# Altium project UZ_PER_SiC_inverter_828xcc.PrjPCB (part 2 of 2)

## Sheet Connectors.SchDoc
size A4; Author: Veit Starost; CompanyName: Technische Hochschule Nürnberg Georg Simon Ohm; Organization: UltraZohm; Address1: Kesslerplatz 12; Address2: 90489 Nürnberg; Address3: GERMANY; Website: www.ultrazohm.com
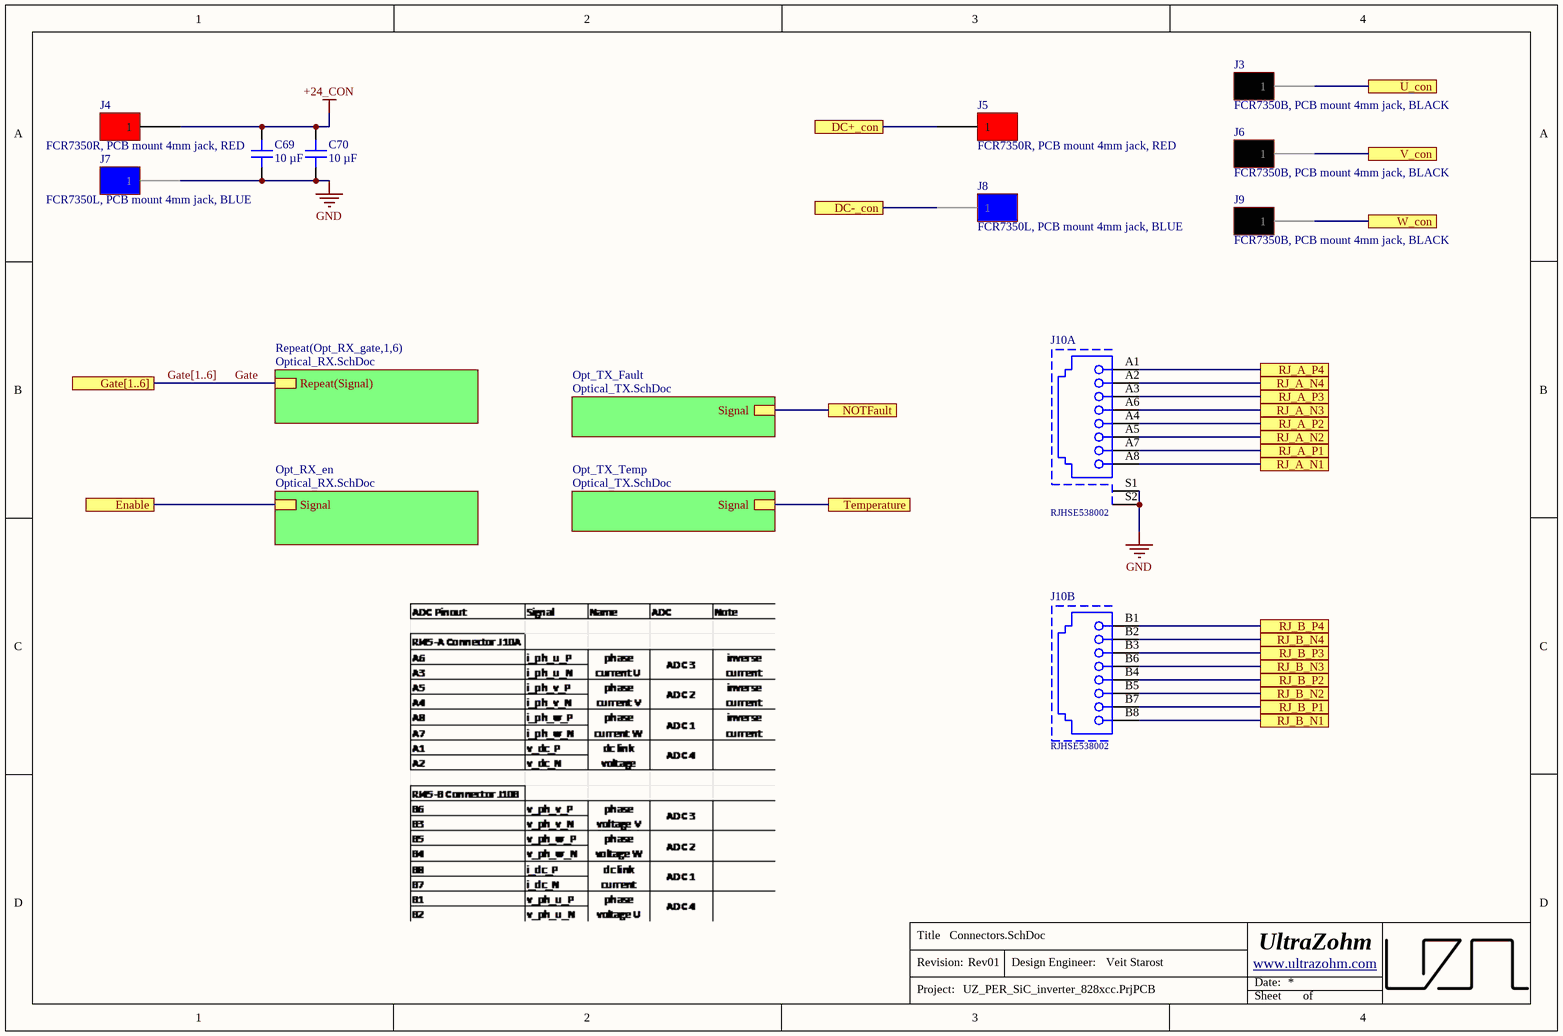
[diagram p4: Connectors.SchDoc]

### Parts
C69  10 µF  [C_1206]
C70  10 µF  [C_1206]
J3  FCR7350B, PCB mount 4mm jack, BLACK  [FCR7350]
J4  FCR7350R, PCB mount 4mm jack, RED  [FCR7350]
J5  FCR7350R, PCB mount 4mm jack, RED  [FCR7350]
J6  FCR7350B, PCB mount 4mm jack, BLACK  [FCR7350]
J7  FCR7350L, PCB mount 4mm jack, BLUE  [FCR7350]
J8  FCR7350L, PCB mount 4mm jack, BLUE  [FCR7350]
J9  FCR7350B, PCB mount 4mm jack, BLACK  [FCR7350]
J10  RJHSE538002  [RJHSE-5380-02]  (parts A,B of 2)

### Sub-sheets
Opt_RX_en = Optical_RX.SchDoc: Signal
Opt_TX_Fault = Optical_TX.SchDoc: Signal
Opt_TX_Temp = Optical_TX.SchDoc: Signal
Repeat(Opt_RX_gate,1,6) = Optical_RX.SchDoc: Repeat(Signal)

### Ports
DC+_con, DC-_con, Enable, Gate[1..6], NOTFault, RJ_A_N1, RJ_A_N2, RJ_A_N3, RJ_A_N4, RJ_A_P1, RJ_A_P2, RJ_A_P3, RJ_A_P4, RJ_B_N1, RJ_B_N2, RJ_B_N3, RJ_B_N4, RJ_B_P1, RJ_B_P2, RJ_B_P3, RJ_B_P4, Temperature, U_con, V_con, W_con

### Nets
+24_CON: C69.2 C70.2 J4.1
DC-: J8.1 ; port DC-_con
GND: C69.1 C70.1 J7.1 J10.S1 J10.S2
Gate: sheet Repeat(Opt_RX_gate,1,6)/Repeat(Signal)
I_IN1: J3.1 ; port U_con
I_IN2: J6.1 ; port V_con
I_IN3: J9.1 ; port W_con
I_IN4: J5.1 ; port DC+_con
I_OUT_N1: J10.A3 ; port RJ_A_P3
I_OUT_N2: J10.A4 ; port RJ_A_P2
I_OUT_N3: J10.A7 ; port RJ_A_P1
I_OUT_N4: J10.B8 ; port RJ_B_N1
I_OUT_P1: J10.A6 ; port RJ_A_N3
I_OUT_P2: J10.A5 ; port RJ_A_N2
I_OUT_P3: J10.A8 ; port RJ_A_N1
I_OUT_P4: J10.B7 ; port RJ_B_P1
V_OUT_N1: J10.B2 ; port RJ_B_N4
V_OUT_N2: J10.B6 ; port RJ_B_N3
V_OUT_N3: J10.B5 ; port RJ_B_N2
V_OUT_N4: J10.A2 ; port RJ_A_N4
V_OUT_P1: J10.B1 ; port RJ_B_P4
V_OUT_P2: J10.B3 ; port RJ_B_P3
V_OUT_P3: J10.B4 ; port RJ_B_P2
V_OUT_P4: J10.A1 ; port RJ_A_P4
NetIC6_6: port Temperature, sheet Opt_TX_Temp/Signal
NetIC10G_4: port Enable, sheet Opt_RX_en/Signal
NetIC11A_2: port NOTFault, sheet Opt_TX_Fault/Signal

### Buses and harness runs
bus Gate[1..6] = port Gate[1..6]

### Notes on the sheet
- Title
- Revision:
- Design Engineer:
- Date:
- Project:
- Sheet
- of

### Library data of the parts
C69 C70 = CGA5L1X7R1H106K160AC: Capacitor 1206, 50 VDC, 10 µF, X7R; Manufacturer: TDK; Tolerance: 10 %; Voltage Rating: 50 VDC; Created from: MGremer; Manufacturer Part Number: CGA5L1X7R1H106K160AC; PartID: 25; Created On: 20.12.2020 13:54:13; ComponentLink1Description: Datasheet; ComponentLink1URL: https://product.tdk.com/info/en/catalog/datasheets/mlcc_automotive_general_en.pdf; Component Type: Capacitor 1206; Device Package: 1206; Last Updated: 27.05.2022 14:15:21; Mounting Type: SMD; Operating Temperature: -55 - 125°C; Series: CGA; Supplier 1: Mouser; Supplier Part Number 1: 810-CGA5L1X7R1H106K1; Type: Capacitor; Value: 10 µF; Live Cycle Status: 1; LCSC Part Number: C13585; Stock number: Labor SMD Container
J3 J6 J9 = FCR7350B: FCR7350B, 1000V, 24A, BLACK; Manufacturer: Cliff; Value: PCB mount 4mm jack, Black	FCR7350B, 1000V, 24A; Created from: DHufnagel; Manufacturer Part Number: FCR7350B; PartID: 6; Created On: 13.06.2022 10:18:11; ComponentLink1Description: datasheet; ComponentLink1URL: https://www.cliffuk.co.uk/products/testleads/sockets/S16NPC.pdf; ComponentLink2Description: drawing; ComponentLink2URL: https://media.digikey.com/pdf/Data%20Sheets/Cliff%20Electronic%20LTD%20PDF's/FCR7350_Drawing.pdf; Component Type: PCB mount 4mm jack, Black; Device Package: THT; Last Updated: 28.06.2022 13:58:37; Minimum Order: 1; Mounting Type: THT; Operating Temperature: -40°C - 80°C; Series: S16N-PC; Supplier 1: Digi-Key; Supplier Part Number 1: 3185-FCR7350B-ND; Supplier 2: farnell; Supplier Part Number 2: 1854507; Type: PCB mount 4mm jack, Black	FCR7350B, 1000V, 24A; Live Cycle Status: 1; Stock number: not stored
J4 J5 = FCR7350R: FCR7350B, 1000V, 24A, RED; Manufacturer: Cliff; Value: PCB mount 4mm jack, Red FCR7350R, 1000V, 24A; Created from: DHufnagel; Manufacturer Part Number: FCR7350R; PartID: 7; Created On: 13.06.2022 10:18:11; ComponentLink1Description: datasheet; ComponentLink1URL: https://www.cliffuk.co.uk/products/testleads/sockets/S16NPC.pdf; ComponentLink2Description: drawing; ComponentLink2URL: https://media.digikey.com/pdf/Data%20Sheets/Cliff%20Electronic%20LTD%20PDF's/FCR7350_Drawing.pdf; Component Type: PCB mount 4mm jack, Red; Device Package: THT; Last Updated: 28.06.2022 13:58:37; Minimum Order: 1; Mounting Type: THT; Operating Temperature: -40°C - 80°C; Series: S16N-PC; Supplier 1: Digi-Key; Supplier Part Number 1: 3185-FCR7350R-ND; Supplier 2: farnell; Supplier Part Number 2: 1854508; Type: PCB mount 4mm jack, Red FCR7350R, 1000V, 24A; Live Cycle Status: 1; Stock number: not stored
J7 J8 = FCR7350L: FCR7350B, 1000V, 24A, BLUE; Manufacturer: Cliff; Value: PCB mount 4mm jack, Blue FCR7350L, 1000V, 24A; Created from: DHufnagel; Manufacturer Part Number: FCR7350L; PartID: 8; Created On: 13.06.2022 10:18:11; ComponentLink1Description: datasheet; ComponentLink1URL: https://www.cliffuk.co.uk/products/testleads/sockets/S16NPC.pdf; ComponentLink2Description: drawing; ComponentLink2URL: https://media.digikey.com/pdf/Data%20Sheets/Cliff%20Electronic%20LTD%20PDF's/FCR7350_Drawing.pdf; Component Type: PCB mount 4mm jack, Blue; Device Package: THT; Last Updated: 28.06.2022 13:58:37; Minimum Order: 1; Mounting Type: THT; Operating Temperature: -40°C - 80°C; Series: S16N-PC; Supplier 1: Digi-Key; Supplier Part Number 1: 3185-FCR7350L-ND; Supplier 2: farnell; Supplier Part Number 2: 1854511; Type: PCB mount 4mm jack, Blue FCR7350L, 1000V, 24A; Live Cycle Status: 1; Stock number: not stored
J10 = RJHSE538002: CAT5, RJ45 Connector, 1x2; Manufacturer: Amphenol; Created from: MGremer; Manufacturer Part Number: RJHSE538002; PartID: 4; Created On: 22.02.2021 16:43:38; ComponentLink1Description: Datasheet; ComponentLink1URL: https://www.farnell.com/cad/2360382.pdf; Component Type: RJ45 Connector; Device Package: RJ45; Last Updated: 22.02.2021 16:43:38; Mounting Type: THT; Series: RJHSE; Supplier 1: Farnell; Supplier Part Number 1: 1860605; Type: RJ45 Connector; Live Cycle Status: 1; Stock number: not stored

## Sheet Optical_RX.SchDoc
size A4; Author: Veit Starost; CompanyName: Technische Hochschule Nürnberg Georg Simon Ohm; Organization: UltraZohm; Address1: Kesslerplatz 12; Address2: 90489 Nürnberg; Address3: GERMANY; Website: www.ultrazohm.com
Used 7 times, as channels U_Connectors/Opt_RX_gate1, U_Connectors/Opt_RX_gate2, U_Connectors/Opt_RX_gate3, U_Connectors/Opt_RX_gate4, U_Connectors/Opt_RX_gate5, U_Connectors/Opt_RX_gate6, U_Connectors/Opt_RX_en. Parts and nets are listed once, with the designators drawn on the sheet.
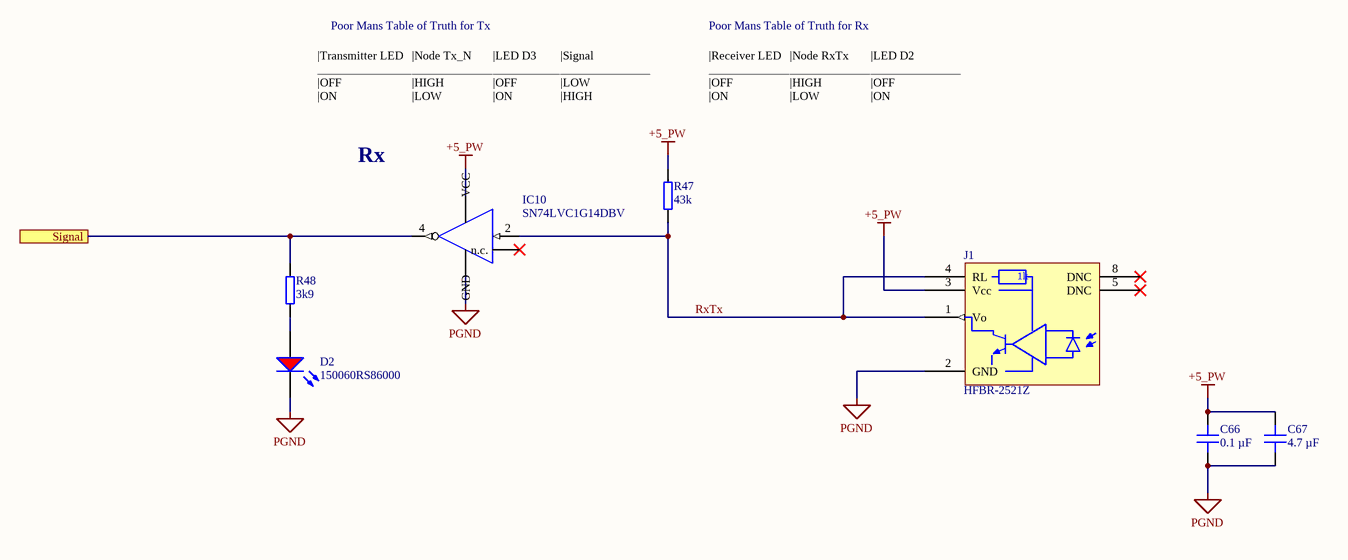
[diagram p5: Optical_RX.SchDoc]

### Parts
C66  0.1 µF  [C_0603]
C67  4.7 µF  [C_0805]
D2  150060RS86000  [WL-SMCW_0603]
IC10  SN74LVC1G14DBV  [SOT23-5_L]
J1  HFBR-2521Z  [HFBRx5XX]
R47  43k  [RES 0603_1608]
R48  3k9  [RES 0603_1608]

### Ports
Signal

### Nets
+5_PW: C66.2 C67.2 IC10.5(VCC) J1.3(Vcc) R47.2
PGND: C66.1 C67.1 D2.1(K) IC10.3(GND) J1.2(GND)
RxTx: IC10.2(A) J1.1(Vo) J1.4(RL) R47.1
Signal: IC10.4(~{Y}) R48.2 ; port Signal
NetD2_2: D2.2(A) R48.1

Not connected (* = marked no-connect by the designer): IC10 1(n.c.)*; J1 5(DNC)* 8(DNC)*

### Channels
U_Connectors/Opt_RX_gate1: designators end in A; ports Signal=Gate1
U_Connectors/Opt_RX_gate2: designators end in B; ports Signal=Gate2
U_Connectors/Opt_RX_gate3: designators end in C; ports Signal=Gate3
U_Connectors/Opt_RX_gate4: designators end in D; ports Signal=Gate4
U_Connectors/Opt_RX_gate5: designators end in E; ports Signal=Gate5
U_Connectors/Opt_RX_gate6: designators end in F; ports Signal=Gate6
U_Connectors/Opt_RX_en: designators end in G; ports Signal=NetIC10G_4

### Notes on the sheet
- Poor Mans Table of Truth for Tx
- Poor Mans Table of Truth for Rx
- |Transmitter LED
  _________________
  |OFF
  |ON
- |Node Tx_N
  _________________
  |HIGH
  |LOW
- |LED D3
  _______________
  |OFF
  |ON
- GATE
  _______
  LOW
  HIGH
- |Signal
  _______________
  |LOW
  |HIGH
- |Receiver LED
  ________________
  |OFF
  |ON
- |Node RxTx
  _________________
  |HIGH
  |LOW
- |LED D2
  _______________
  |OFF
  |ON
- Rx
- Title
- Revision:
- Design Engineer:
- Date:
- Project:
- Sheet
- of
- (in symbol HFBR-2521Z) 1k

### Library data of the parts
C66 = C0603X104K5RAC7411: Capacitor 0603, 50 VDC, 0.1 µF, X7R; Manufacturer: KEMET; Tolerance: 10 %; Voltage Rating: 50 VDC; Created from: MGremer; Manufacturer Part Number: C0603X104K5RAC7411; PartID: 3; Created On: 20.12.2020 13:54:13; ComponentLink1Description: Datasheet; ComponentLink1URL: https://www.mouser.de/datasheet/2/212/1/KEM_C1013_X7R_FT_CAP_SMD-1103280.pdf; Component Type: Capacitor 0603; Device Package: 0603; Last Updated: 04.03.2021 09:24:28; Mounting Type: SMD; Operating Temperature: -55 - 125°C; Series: SMD Comm X7R Flex; Supplier 1: Mouser; Supplier Part Number 1: 80-C0603X104K5R7411; Supplier 2: LCSC; Supplier Part Number 2: C14663; Type: Capacitor; Value: 0.1 µF; Live Cycle Status: 1; LCSC Part Number: C14663; Stock number: Labor SMD Container
C67 = C2012X7R1H475K125AC: Capacitor 0805, 50 VDC, 4.7 µF, X7R; Manufacturer: TDK; Tolerance: 10 %; Voltage Rating: 50 VDC; Created from: MGremer; Manufacturer Part Number: C2012X7R1H475K125AC; PartID: 15; Created On: 20.12.2020 13:54:13; ComponentLink1Description: Datasheet; ComponentLink1URL: https://product.tdk.com/info/en/catalog/datasheets/mlcc_commercial_general_en.pdf; Component Type: Capacitor 0805; Device Package: 0805; Last Updated: 20.12.2020 16:34:30; Mounting Type: SMD; Operating Temperature: -55 - 125°C; Series: C; Supplier 1: Mouser; Supplier Part Number 1: 810-C2012X7R475K125C; Type: Capacitor; Value: 4.7 µF; Live Cycle Status: 1; Stock number: Labor SMD Container
D2 = 150060RS86000: WL-SMCW SMD Mono-color Chip LED Waterclear Red; Manufacturer: Wuerth Elektronik; Type: Standard; Created from: MGremer; Forward Current I_f: 20 mA; Forward Voltage U_f: 2 V; Wavelength: 624 nm; Light Intensity: 800 mcd; Nominal Power: 48 mW; Manufacturer Part Number: 150060RS86000; PartID: 3; Created On: 08.12.2020 10:48:12; ComponentLink1Description: Datasheet; ComponentLink1URL: https://www.mouser.de/datasheet/2/445/150120RS75000-1714636.pdf; Component Type: LED Diode; Device Package: 0603; Last Updated: 15.02.2023 18:12:03; Mounting Type: SMD; Operating Temperature: -40 - 85 °C; Supplier 1: Mouser; Supplier Part Number 1: 710-150060RS86000; Supplier 2: Farnell; Supplier Part Number 2: 3408608; Supplier 3: Digi-Key; Supplier Part Number 3: 732-150060RS86000CT-ND; Live Cycle Status: 1; Stock number: not stored; Color: red; LCSC Part Number: C389517
IC10 = SN74LVC1G14DBV: Inverting Schmitt trigger; Manufacturer: Texas Instruments; Value: 5.5 V; Created from: VStarost; Manufacturer Part Number: SN74LVC1G14DBV; PartID: 3; Created On: 13.12.2022 09:50:11; ComponentLink1Description: Datasheet; ComponentLink1URL: https://www.ti.com/lit/ds/symlink/sn74lvc1g14.pdf?HQS=dis-mous-null-mousermode-dsf-pf-null-wwe&ts=1670840401866&ref_url=https%253A%252F%252Fwww.mouser.de%252F; Component Type: Inverting Schmitt trigger; Device Package: SOT-23-5; Last Updated: 15.02.2023 18:15:19; Mounting Type: SMD; Operating Temperature: -40 - 125 °C; Series: SN74LVC1G14; Supplier 1: Mouser; Supplier Part Number 1: 595-SN74LVC1G14DBVT; Type: Schmitt trigger; Live Cycle Status: 1; Stock number: not stored; LCSC Part Number: C434069
J1 = HFBR-2521Z: Fibre Optic Receivers, LINK HORIZ 5MBd RC VR RoHS; Suppier Part Number 2: 516-2062-ND; Manufacturer: Broadcom; MF: Boadcom/Avago; Wavelength: 660 nm; Iout max: 25 mA; Supply Voltage: 5V; Created from: VStarost; Created: 2019_04_09_Kreppel; MPN: HFBR-2521Z; Data Rate: 5 MBd; Supplier 1: Mouser; Supplier Part Number 1: 630-HFBR-2521Z; Manufacturer Part Number: HFBR-2521Z; PartID: 1; Created On: 27.12.2022 09:44:37; ComponentLink1Description: Datasheet; ComponentLink1URL: https://datasheet.ciiva.com/19453/1584669-19453911.pdf?src-supplier=Jameco; Component Type: LWL Receiver; Device Package: THT; Last Updated: 27.12.2022 09:44:37; Mounting Type: THT; Series: HFBR; Type: LWL Receiver; Live Cycle Status: 1; Stock number: not stored
R47 = RK73B1JTTD433J: SMD resistor E24 series; Manufacturer: KOA Speer; Tolerance: 5%; Created from: MGremer; Manufacturer Part Number: RK73B1JTTD433J; PartID: 113; Created On: 14.12.2020 16:17:14; ComponentLink1Description: Datasheet; ComponentLink1URL: https://www.mouser.de/datasheet/2/219/RK73B-1825463.pdf; Component Type: SMD resistor; Device Package: 0603; Last Updated: 15.02.2023 17:49:44; Mounting Type: SMD; Supplier 1: Mouser; Supplier Part Number 1: 660-RK73B1JTTD433J; Type: Resistor; Value: 43k; Live Cycle Status: 1; Stock number: Labor SMD Container; LCSC Part Number: C177391
R48 = RK73B1JTTDD392J: SMD resistor E24 series; Manufacturer: KOA Speer; Tolerance: 5%; Created from: MGremer; Manufacturer Part Number: RK73B1JTTDD392J; PartID: 88; Created On: 14.12.2020 16:17:14; ComponentLink1Description: Datasheet; ComponentLink1URL: https://www.mouser.de/datasheet/2/219/RK73B-1825463.pdf; Component Type: SMD resistor; Device Package: 0603; Last Updated: 15.02.2023 17:47:58; Mounting Type: SMD; Supplier 1: Mouser; Supplier Part Number 1: 660-RK73B1JTTDD392J; Type: Resistor; Value: 3k9; Live Cycle Status: 1; Stock number: Labor SMD Container; LCSC Part Number: C177310

## Sheet Optical_TX.SchDoc
size A4; Author: Veit Starost; CompanyName: Technische Hochschule Nürnberg Georg Simon Ohm; Organization: UltraZohm; Address1: Kesslerplatz 12; Address2: 90489 Nürnberg; Address3: GERMANY; Website: www.ultrazohm.com
Used 2 times, as channels U_Connectors/Opt_TX_Fault, U_Connectors/Opt_TX_Temp. Parts and nets are listed once, with the designators drawn on the sheet.
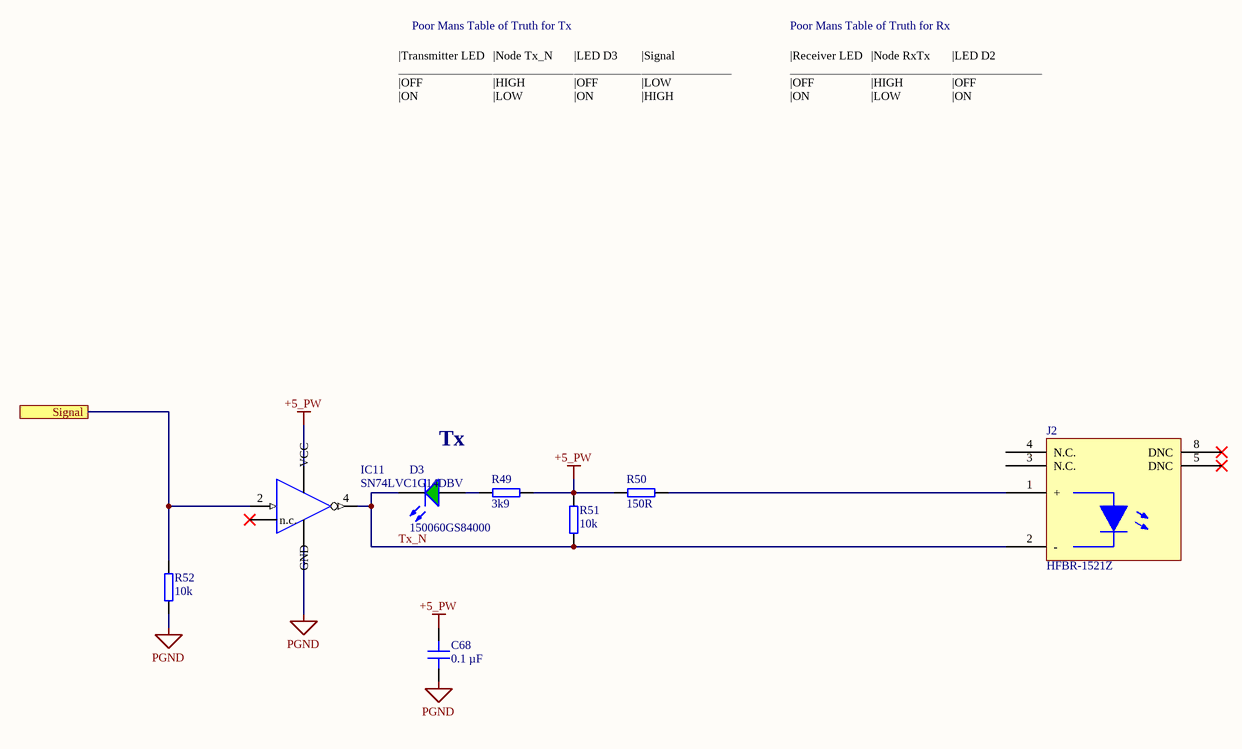
[diagram p6: Optical_TX.SchDoc]

### Parts
C68  0.1 µF  [C_0603]
D3  150060GS84000  [WL-SMCW_0603]
IC11  SN74LVC1G14DBV  [SOT23-5_L]
J2  HFBR-1521Z  [HFBRx5XX]
R49  3k9  [RES 0603_1608]
R50  150R  [RES 0603_1608]
R51  10k  [RES 0603_1608]
R52  10k  [RES 0603_1608]

### Ports
Signal

### Nets
+5_PW: C68.2 IC11.5(VCC) R49.2 R50.1 R51.2
PGND: C68.1 IC11.3(GND) R52.1
Signal: IC11.2(A) R52.2 ; port Signal
Tx_N: D3.1(K) IC11.4(~{Y}) J2.2(-) R51.1
NetD3_2: D3.2(A) R49.1
NetJ2_1: J2.1(+) R50.2

Not connected (* = marked no-connect by the designer): IC11 1(n.c.)*; J2 3(N.C.) 4(N.C.) 5(DNC)* 8(DNC)*

### Channels
U_Connectors/Opt_TX_Fault: designators end in A; ports Signal=NetIC11A_2
U_Connectors/Opt_TX_Temp: designators end in B; ports Signal=NetIC6_6

### Notes on the sheet
- Poor Mans Table of Truth for Tx
- Poor Mans Table of Truth for Rx
- |Transmitter LED
  _________________
  |OFF
  |ON
- |Node Tx_N
  _________________
  |HIGH
  |LOW
- |LED D3
  _______________
  |OFF
  |ON
- GATE
  _______
  LOW
  HIGH
- |Signal
  _______________
  |LOW
  |HIGH
- |Receiver LED
  ________________
  |OFF
  |ON
- |Node RxTx
  _________________
  |HIGH
  |LOW
- |LED D2
  _______________
  |OFF
  |ON
- Tx
- Title
- Revision:
- Design Engineer:
- Date:
- Project:
- Sheet
- of

### Library data of the parts
C68 = C0603X104K5RAC7411: as C66 on sheet Optical_RX; Manufacturer Part Number: C0603X104K5RAC7411; PartID: 3; Created On: 20.12.2020 13:54:13; ComponentLink1Description: Datasheet; ComponentLink1URL: https://www.mouser.de/datasheet/2/212/1/KEM_C1013_X7R_FT_CAP_SMD-1103280.pdf; Component Type: Capacitor 0603; Device Package: 0603; Last Updated: 04.03.2021 09:24:28; Mounting Type: SMD; Operating Temperature: -55 - 125°C; Series: SMD Comm X7R Flex; Supplier 1: Mouser; Supplier Part Number 1: 80-C0603X104K5R7411; Supplier 2: LCSC; Supplier Part Number 2: C14663; Type: Capacitor; Value: 0.1 µF; Live Cycle Status: 1; LCSC Part Number: C14663; Stock number: Labor SMD Container
D3 = 150060GS84000: WL-SMCW SMD Mono-color Chip LED Waterclear Green; Manufacturer: Wuerth Elektronik; Type: Standard; Created from: MGremer; Forward Current I_f: 20 mA; Forward Voltage U_f: 3.2 V; Wavelength: 525 nm; Light Intensity: 3000 mcd; Nominal Power: 78 mW; Manufacturer Part Number: 150060GS84000; PartID: 2; Created On: 08.12.2020 10:41:11; ComponentLink1Description: Datasheet; ComponentLink1URL: https://www.mouser.de/datasheet/2/445/150060GS75020-1714345.pdf; Component Type: LED Diode; Device Package: 0603; Last Updated: 03.03.2021 09:59:51; Mounting Type: SMD; Operating Temperature: -40 - 85 °C; Supplier 1: Mouser; Supplier Part Number 1: 710-150060GS84000; Supplier 2: Farnell; Supplier Part Number 2: 3408612; Supplier 3: Digi-Key; Supplier Part Number 3: 732-150060GS84000CT-ND; Live Cycle Status: 1; Stock number: not stored; Color: green
IC11 = SN74LVC1G14DBV: as IC10 on sheet Optical_RX; Manufacturer Part Number: SN74LVC1G14DBV; PartID: 3; Created On: 13.12.2022 09:50:11; ComponentLink1Description: Datasheet; ComponentLink1URL: https://www.ti.com/lit/ds/symlink/sn74lvc1g14.pdf?HQS=dis-mous-null-mousermode-dsf-pf-null-wwe&ts=1670840401866&ref_url=https%253A%252F%252Fwww.mouser.de%252F; Component Type: Inverting Schmitt trigger; Device Package: SOT-23-5; Last Updated: 15.02.2023 18:15:19; Mounting Type: SMD; Operating Temperature: -40 - 125 °C; Series: SN74LVC1G14; Supplier 1: Mouser; Supplier Part Number 1: 595-SN74LVC1G14DBVT; Type: Schmitt trigger; Live Cycle Status: 1; Stock number: not stored; LCSC Part Number: C434069
J2 = HFBR-1521Z: Fibre Optic Transmitters, Link Horiz 5MBd Tx RoHS; Manufacturer: Broadcom; MF: Broadcom/Avago; Wavelength: 660 nm; Foreward Current: 60 mA; Supply Voltage: 5V; Created from: VStarost; Created: 2019_04_09_Kreppel; MPN: HFBR-1521Z; Data Rate: 5 MBd; Supplier 1: Mouser; Supplier Part Number 1: 630-HFBR-1521Z; Manufacturer Part Number: HFBR-1521Z; PartID: 2; Created On: 27.12.2022 10:35:16; ComponentLink1Description: Datasheet; ComponentLink1URL: https://datasheet.ciiva.com/19453/1584669-19453911.pdf?src-supplier=Jameco; Component Type: LWL Transmitter; Device Package: THT; Last Updated: 27.12.2022 10:35:16; Mounting Type: THT; Series: HFBR; Type: LWL Transmitter; Live Cycle Status: 1; Stock number: not stored
R49 = RK73B1JTTDD392J: as R48 on sheet Optical_RX; Manufacturer Part Number: RK73B1JTTDD392J; PartID: 88; Created On: 14.12.2020 16:17:14; ComponentLink1Description: Datasheet; ComponentLink1URL: https://www.mouser.de/datasheet/2/219/RK73B-1825463.pdf; Component Type: SMD resistor; Device Package: 0603; Last Updated: 15.02.2023 17:47:58; Mounting Type: SMD; Supplier 1: Mouser; Supplier Part Number 1: 660-RK73B1JTTDD392J; Type: Resistor; Value: 3k9; Live Cycle Status: 1; Stock number: Labor SMD Container; LCSC Part Number: C177310
R50 = RK73B1JTTD151J: SMD resistor E24 series; Manufacturer: KOA Speer; Tolerance: 5%; Created from: MGremer; Manufacturer Part Number: RK73B1JTTD151J; PartID: 54; Created On: 14.12.2020 16:17:14; ComponentLink1Description: Datasheet; ComponentLink1URL: https://www.mouser.de/datasheet/2/219/RK73B-1825463.pdf; Component Type: SMD resistor; Device Package: 0603; Last Updated: 27.05.2022 13:41:55; Mounting Type: SMD; Supplier 1: Mouser; Supplier Part Number 1: 660-RK73B1JTTD151J; Type: Resistor; Value: 150R; Live Cycle Status: 1; Stock number: Labor SMD Container; LCSC Part Number: C22808
R51 R52 = RK73B1JTTD103J: SMD resistor E24 series; Manufacturer: KOA Speer; Tolerance: 5%; Created from: MGremer; Manufacturer Part Number: RK73B1JTTD103J; PartID: 98; Created On: 14.12.2020 16:17:14; ComponentLink1Description: Datasheet; ComponentLink1URL: https://www.mouser.de/datasheet/2/219/RK73B-1825463.pdf; Component Type: SMD resistor; Device Package: 0603; Last Updated: 27.05.2022 14:04:22; Mounting Type: SMD; Supplier 1: Mouser; Supplier Part Number 1: 660-RK73B1JTTD103J; Type: Resistor; Value: 10k; Live Cycle Status: 1; Stock number: Labor SMD Container; LCSC Part Number: C25804

## Sheet Voltage_Measurement.SchDoc
size A4; Author: Veit Starost; CompanyName: Technische Hochschule Nürnberg Georg Simon Ohm; Organization: UltraZohm; Address1: Kesslerplatz 12; Address2: 90489 Nürnberg; Address3: GERMANY; Website: www.ultrazohm.com
Used 4 times, as channels U_Voltage_Measurement1, U_Voltage_Measurement2, U_Voltage_Measurement3, U_Voltage_Measurement4. Parts and nets are listed once, with the designators drawn on the sheet.
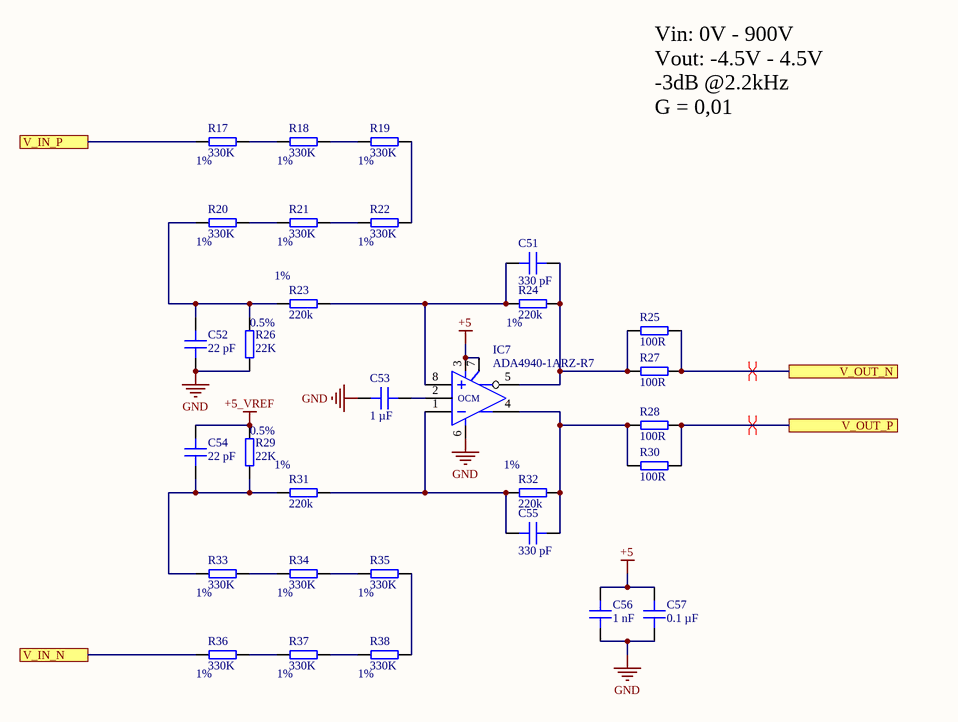
[diagram p7: Voltage_Measurement.SchDoc]

### Parts
C51  330 pF  [C_0603]
C52  22 pF  [C_0603]
C53  1 µF  [C_0603]
C54  22 pF  [C_0603]
C55  330 pF  [C_0603]
C56  1 nF  [C_0603]
C57  0.1 µF  [C_0603]
IC7  ADA4940-1ARZ-R7  [SOIC-8-N]
R17  330K  Tolerance: 1%  [RES 1206_3216]
R18  330K  Tolerance: 1%  [RES 1206_3216]
R19  330K  Tolerance: 1%  [RES 1206_3216]
R20  330K  Tolerance: 1%  [RES 1206_3216]
R21  330K  Tolerance: 1%  [RES 1206_3216]
R22  330K  Tolerance: 1%  [RES 1206_3216]
R23  220k  Tolerance: 1%  [RES 0603_1608]
R24  220k  Tolerance: 1%  [RES 0603_1608]
R25  100R  [RES 0603_1608]
R26  22K  Tolerance: 0.5%  [RES 0603_1608]
R27  100R  [RES 0603_1608]
R28  100R  [RES 0603_1608]
R29  22K  Tolerance: 0.5%  [RES 0603_1608]
R30  100R  [RES 0603_1608]
R31  220k  Tolerance: 1%  [RES 0603_1608]
R32  220k  Tolerance: 1%  [RES 0603_1608]
R33  330K  Tolerance: 1%  [RES 1206_3216]
R34  330K  Tolerance: 1%  [RES 1206_3216]
R35  330K  Tolerance: 1%  [RES 1206_3216]
R36  330K  Tolerance: 1%  [RES 1206_3216]
R37  330K  Tolerance: 1%  [RES 1206_3216]
R38  330K  Tolerance: 1%  [RES 1206_3216]

### Ports
V_IN_N, V_IN_P, V_OUT_N, V_OUT_P

### Nets
+5: C56.2 C57.2 IC7.3(V+) IC7.7(EN)
+5_VREF: C54.2 R29.2
GND: C52.1 C53.1 C56.1 C57.1 IC7.6(V-) R26.1
V_IN_N: R36.1 ; port V_IN_N
V_IN_P: R17.1 ; port V_IN_P
V_OUT_N: R25.2 R27.2 ; port V_OUT_N
V_OUT_P: R28.2 R30.2 ; port V_OUT_P
NetC51_1: C51.1 IC7.8(+) R23.2 R24.1
NetC51_2: C51.2 IC7.5(Out) R24.2 R25.1 R27.1
NetC52_2: C52.2 R20.1 R23.1 R26.2
NetC53_2: C53.2 IC7.2(OCM)
NetC54_1: C54.1 R29.1 R31.1 R33.1
NetC55_1: C55.1 IC7.1(-) R31.2 R32.1
NetC55_2: C55.2 IC7.4(Out) R28.1 R30.1 R32.2
NetR17_2: R17.2 R18.1
NetR18_2: R18.2 R19.1
NetR19_2: R19.2 R22.2
NetR20_2: R20.2 R21.1
NetR21_2: R21.2 R22.1
NetR33_2: R33.2 R34.1
NetR34_2: R34.2 R35.1
NetR35_2: R35.2 R38.2
NetR36_2: R36.2 R37.1
NetR37_2: R37.2 R38.1

### Channels
U_Voltage_Measurement1: designators end in A; ports V_IN_N=DC- V_IN_P=I_M_OUT1 V_OUT_N=V_OUT_N1 V_OUT_P=V_OUT_P1
U_Voltage_Measurement2: designators end in B; ports V_IN_N=DC- V_IN_P=I_M_OUT2 V_OUT_N=V_OUT_N2 V_OUT_P=V_OUT_P2
U_Voltage_Measurement3: designators end in C; ports V_IN_N=DC- V_IN_P=I_M_OUT3 V_OUT_N=V_OUT_N3 V_OUT_P=V_OUT_P3
U_Voltage_Measurement4: designators end in D; ports V_IN_N=DC- V_IN_P=I_M_OUT4 V_OUT_N=V_OUT_N4 V_OUT_P=V_OUT_P4

### Layout directives
differential pair: V_OUT_N1, V_OUT_P1

### Notes on the sheet
- Vin: 0V - 900V
  Vout: -4.5V - 4.5V
  -3dB @2.2kHz
  G = 0,01
- Title
- Revision:
- Design Engineer:
- Date:
- Project:
- Sheet
- of

### Library data of the parts
C51 C55 = C0603X331J5RAC3112: Capacitor 0603, 50 VDC, 330 pF, X7R; Manufacturer: KEMET; Tolerance: 5 %; Voltage Rating: 50 VDC; Created from: MGremer; Manufacturer Part Number: C0603X331J5RAC3112; PartID: 8; Created On: 20.12.2020 13:54:13; ComponentLink1Description: Datasheet; ComponentLink1URL: https://www.mouser.de/datasheet/2/212/1/KEM_C1013_X7R_FT_CAP_SMD-1103280.pdf; Component Type: Capacitor 0603; Device Package: 0603; Last Updated: 15.02.2023 17:14:22; Mounting Type: SMD; Operating Temperature: -55 - 125°C; Series: SMD Comm X7R Flex; Supplier 1: Mouser; Supplier Part Number 1: 80-C0603X331J5R3112; Type: Capacitor; Value: 330 pF; Live Cycle Status: 1; Stock number: Labor SMD Container; Supplier 2: LCSC; Supplier Part Number 2: C107087
C52 C54 = C0603C220J5RACTU: Capacitor 0603, 50 VDC, 22 pF, X7R; Manufacturer: KEMET; Tolerance: 5 %; Voltage Rating: 50 VDC; Created from: MGremer; Manufacturer Part Number: C0603C220J5RACTU; PartID: 78; Created On: 20.12.2020 13:54:13; ComponentLink1Description: Datasheet; ComponentLink1URL: https://www.mouser.de/datasheet/2/212/KEM_C1002_X7R_SMD-1102033.pdf; Component Type: Capacitor 0603; Device Package: 0603; Last Updated: 20.01.2021 13:57:36; Mounting Type: SMD; Operating Temperature: -55 - 125°C; Series: SMD Comm X7R; Supplier 1: Mouser; Supplier Part Number 1: 80-C0603C220J5R; Type: Capacitor; Value: 22 pF; Live Cycle Status: 1; Stock number: not stored
C53 = UMK107AB7105KA-T: 50V 1uF X7R ±10% 0603 Multilayer Ceramic Capacitors MLCC - SMD/SMT ROHS; Manufacturer: Taiyo Yuden; Voltage Rating: 50 VDC; Created from: NDiringer; Manufacturer Part Number: UMK107AB7105KA-T; PartID: 98; Created On: 09.08.2022 09:35:02; ComponentLink1Description: Datasheet; ComponentLink1URL: https://www.mouser.de/datasheet/2/396/mlcc02_e-1307760.pdf; Component Type: Capacitor 0603; Device Package: 0603; Last Updated: 21.09.2022 16:11:37; Mounting Type: SMD; Operating Temperature: -55 - 125°C; Series: X7R; Supplier 1: LCSC; Supplier Part Number 1: C105174; Supplier 2: Mouser; Supplier Part Number 2: 963-UMK107AB7105MA-T; Type: Capacitor; Tolerance: 10 %; Value: 1 µF; Live Cycle Status: 1; LCSC Part Number: C105174; Stock number: not stored
C56 = CC0603JRNPO9BN102: Capacitor 0603, 50 VDC, 1 nF, NP0; Manufacturer: YAGEO; Tolerance: 5 %; Voltage Rating: 50 VDC; Created from: AGeiger; Manufacturer Part Number: CC0603JRNPO9BN102; PartID: 104; Created On: 30.08.2022 11:46:28; ComponentLink1Description: Datasheet; ComponentLink1URL: https://datasheet.lcsc.com/lcsc/1811021411_YAGEO-CC0603JRNPO9BN102_C106246.pdf; Component Type: Capacitor 0603; Device Package: 0603; Last Updated: 30.08.2022 11:46:28; Mounting Type: SMD; Operating Temperature: -55 - 125°C; Series: NP0; Supplier 1: LCSC; Supplier Part Number 1: C106246; Type: Capacitor; Value: 1 nF; Live Cycle Status: 1; LCSC Part Number: C106246
C57 = C0603X104K5RAC7411: as C66 on sheet Optical_RX; Manufacturer Part Number: C0603X104K5RAC7411; PartID: 3; Created On: 20.12.2020 13:54:13; ComponentLink1Description: Datasheet; ComponentLink1URL: https://www.mouser.de/datasheet/2/212/1/KEM_C1013_X7R_FT_CAP_SMD-1103280.pdf; Component Type: Capacitor 0603; Device Package: 0603; Last Updated: 04.03.2021 09:24:28; Mounting Type: SMD; Operating Temperature: -55 - 125°C; Series: SMD Comm X7R Flex; Supplier 1: Mouser; Supplier Part Number 1: 80-C0603X104K5R7411; Supplier 2: LCSC; Supplier Part Number 2: C14663; Type: Capacitor; Value: 0.1 µF; Live Cycle Status: 1; LCSC Part Number: C14663; Stock number: Labor SMD Container
IC7 = ADA4940-1ARZ-R7: Differential ADC Driver; Manufacturer: Analog Devices; Class I: Analog; Class II: Fully Differential ADC Drivers (-40-125°C); Best.-Nr.: Farnell 209-6178; Channels: 1; Created from: MGremer; Datasheet: DSO11449, Ver. Aug 2000; Last edited: 04.01.2007 10:14; Package Reference: SOIC-N-8; Manufacturer Part Number: ADA4940-1ARZ-R7; PartID: 3; Created On: 15.01.2021 12:16:53; ComponentLink1Description: Datasheet; ComponentLink1URL: https://www.mouser.de/datasheet/2/609/ADA4940-1_4940-2-878284.pdf; Component Type: ADC; Device Package: SOIC-8; Last Updated: 22.11.2021 15:19:18; Mounting Type: SMD; Operating Temperature: -40 - 105 °C; Supplier 1: Mouser; Supplier Part Number 1: 584-ADA4940-1ARZ-R7; Type: ADC; Resolution: -; Value: differential ADC driver; Live Cycle Status: 1; Stock number: not stored
R17-R22 R33-R38 = RT1206FRE07330KL: SMD resistor E24 series 330K OHM 1% 50PPM 1/4W; Manufacturer: YAGEO; Created from: StarostV; Manufacturer Part Number: RT1206FRE07330KL; PartID: 254; Created On: 02.02.2023 10:18:00; ComponentLink1Description: Datasheet; ComponentLink1URL: https://www.mouser.de/datasheet/2/447/PYu_RT_1_to_0_01_RoHS_L_12-3003070.pdf; Component Type: SMD resistor; Device Package: 1206; Last Updated: 15.02.2023 17:25:43; Mounting Type: SMD; Supplier 1: Mouser; Supplier Part Number 1: 603-RT1206FRE07330KL; Type: Resistor; Value: 330K; Live Cycle Status: 1; Stock number: not stored; LCSC Part Number: C706451
R23 R24 R31 R32 = AC0603FR-07220KL: SMD resistor 1%; Manufacturer: YAGEO; Created from: VStarost; Manufacturer Part Number: AC0603FR-07220KL; PartID: 251; Created On: 28.12.2022 09:11:18; ComponentLink1Description: Datasheet; ComponentLink1URL: https://www.mouser.de/datasheet/2/447/PYu_AC_51_RoHS_L_9-3005297.pdf; Component Type: SMD resistor; Device Package: 0603; Last Updated: 15.02.2023 17:42:19; Mounting Type: SMD; Supplier 1: Mouser; Supplier Part Number 1: 603-AC0603FR-07220KL; Type: Resistor; Value: 220k; Live Cycle Status: 1; Stock number: not stored; LCSC Part Number: C304719
R25 R27 R28 R30 = RK73B1JTTD101J: SMD resistor E24 series; Manufacturer: KOA Speer; Tolerance: 5%; Created from: MGremer; Manufacturer Part Number: RK73B1JTTD101J; PartID: 50; Created On: 14.12.2020 16:17:14; ComponentLink1Description: Datasheet; ComponentLink1URL: https://www.mouser.de/datasheet/2/219/RK73B-1825463.pdf; Component Type: SMD resistor; Device Package: 0603; Last Updated: 29.11.2022 14:30:07; Mounting Type: SMD; Supplier 1: Mouser; Supplier Part Number 1: 660-RK73B1JTTD101J; Supplier 2: LCSC; Supplier Part Number 2: C22775; Type: Resistor; Value: 100R; Live Cycle Status: 1; Stock number: Labor SMD Container; LCSC Part Number: C22775
R26 R29 = RT0603DRE0722KL: SMD resistor E24 series 22K 0.5% 1/10W 75 Volts 50ppm; Manufacturer: YAGEO; Created from: VStarost; Manufacturer Part Number: RT0603DRE0722KL; PartID: 255; Created On: 02.02.2023 11:53:54; ComponentLink1Description: Datasheet; ComponentLink1URL: https://www.mouser.de/datasheet/2/447/PYu_RT_1_to_0_01_RoHS_L_12-3003070.pdf; Component Type: SMD resistor; Device Package: 0603; Last Updated: 15.02.2023 18:00:16; Mounting Type: SMD; Supplier 1: Mouser; Supplier Part Number 1: 603-RT0603DRE0722KL; Type: Resistor; Value: 22K; Live Cycle Status: 1; Stock number: not stored; LCSC Part Number: C705960

## Sheet OC_Trigger.SchDoc
size A4; Author: Veit Starost; CompanyName: Technische Hochschule Nürnberg Georg Simon Ohm; Organization: UltraZohm; Address1: Kesslerplatz 12; Address2: 90489 Nürnberg; Address3: GERMANY; Website: www.ultrazohm.com
Used 4 times, as channels U_OC_Trigger1, U_OC_Trigger2, U_OC_Trigger3, U_OC_Trigger4. Parts and nets are listed once, with the designators drawn on the sheet.
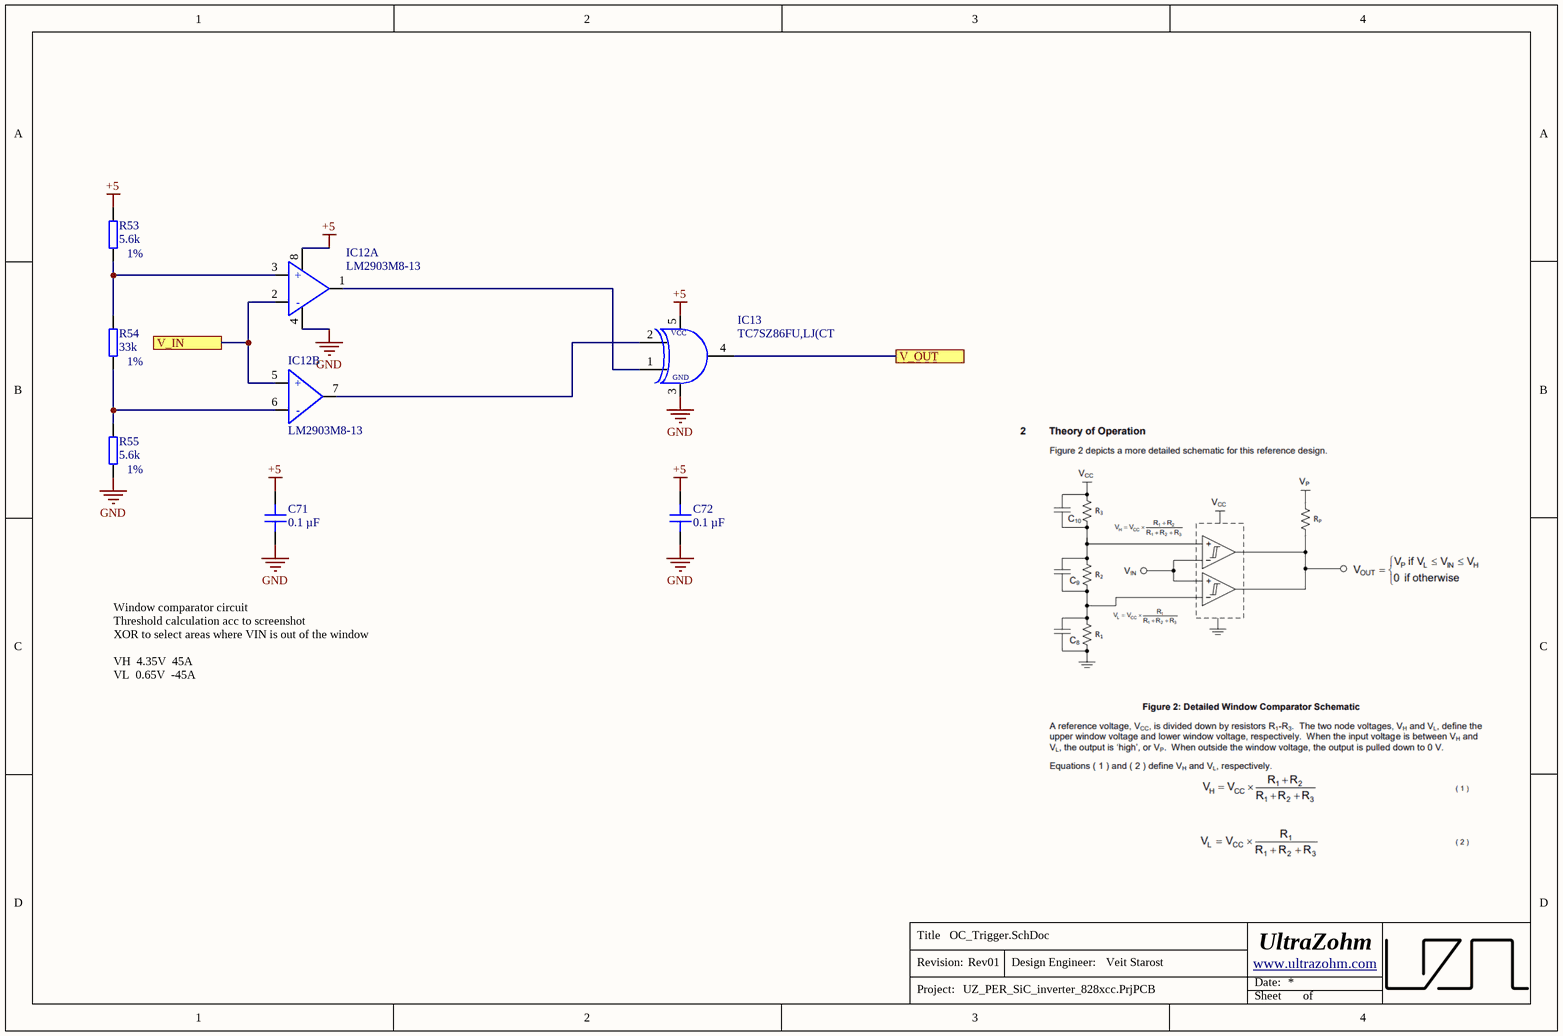
[diagram p8: OC_Trigger.SchDoc]

### Parts
C71  0.1 µF  [C_0603]
C72  0.1 µF  [C_0603]
IC12  LM2903M8-13  [MSOP-8 (RM-8)]  (parts A,B of 2)
IC13  TC7SZ86FU,LJ(CT  [SOT353-1_N]
R53  5.6k  Tolerance: 1%  [RES 0603_1608]
R54  33k  Tolerance: 1%  [RES 0603_1608]
R55  5.6k  Tolerance: 1%  [RES 0603_1608]

### Ports
V_IN, V_OUT

### Nets
+5: C71.2 C72.2 IC12.8 IC13.5 R53.2
GND: C71.1 C72.1 IC12.4 IC13.3 R55.1
V_IN: IC12.2(-) IC12.5(+) ; port V_IN
V_OUT: IC13.4 ; port V_OUT
NetIC12_1: IC12.1 IC13.1
NetIC12_3: IC12.3(+) R53.1 R54.2
NetIC12_6: IC12.6(-) R54.1 R55.2
NetIC12_7: IC12.7 IC13.2

### Channels
U_OC_Trigger1: designators end in A; ports V_IN=OC_IN1 V_OUT=OC_OUT1
U_OC_Trigger2: designators end in B; ports V_IN=OC_IN2 V_OUT=OC_OUT2
U_OC_Trigger3: designators end in C; ports V_IN=OC_IN3 V_OUT=OC_OUT3
U_OC_Trigger4: designators end in D; ports V_IN=OC_IN4 V_OUT=OC_OUT4

### Notes on the sheet
- Window comparator circuit
  Threshold calculation acc to screenshot
  XOR to select areas where VIN is out of the window
  VH  4.35V  45A
  VL  0.65V  -45A
- Title
- Revision:
- Design Engineer:
- Date:
- Project:
- Sheet
- of
- (in symbol TC7SZ86FU,LJ(CT) VCC; GND

### Library data of the parts
C71 C72 = C0603X104K5RAC7411: as C66 on sheet Optical_RX; Manufacturer Part Number: C0603X104K5RAC7411; PartID: 3; Created On: 20.12.2020 13:54:13; ComponentLink1Description: Datasheet; ComponentLink1URL: https://www.mouser.de/datasheet/2/212/1/KEM_C1013_X7R_FT_CAP_SMD-1103280.pdf; Component Type: Capacitor 0603; Device Package: 0603; Last Updated: 04.03.2021 09:24:28; Mounting Type: SMD; Operating Temperature: -55 - 125°C; Series: SMD Comm X7R Flex; Supplier 1: Mouser; Supplier Part Number 1: 80-C0603X104K5R7411; Supplier 2: LCSC; Supplier Part Number 2: C14663; Type: Capacitor; Value: 0.1 µF; Live Cycle Status: 1; LCSC Part Number: C14663; Stock number: Labor SMD Container
IC12 = LM2903M8-13: Analoge Komparatoren Comparator; Manufacturer: Diodes Incorporated; Channels: 2; Created from: VStarost; Manufacturer Part Number: LM2903M8-13; PartID: 19; Created On: 31.01.2023 09:11:50; ComponentLink1Description: Datasheet; ComponentLink1URL: https://www.mouser.de/datasheet/2/115/DIOD_S_A0006493411_1-2542964.pdf; Component Type: Dual Comparator; Device Package: MSOP-8; Last Updated: 31.01.2023 09:11:50; Mounting Type: SMD; Operating Temperature: -40 - 125°C; Series: LM2903; Supplier 1: Mouser; Supplier Part Number 1: 621-LM2903M8-13; Type: Comparator; Live Cycle Status: 1; Stock number: not stored
IC13 = TC7SZ86FU,LJ(CT: IC GATE XOR 1CH 2-INP USV; Manufacturer: Toshiba; Value: 5.5 V; Created from: VStarost; Manufacturer Part Number: TC7SZ86FU,LJ(CT; PartID: 4; Created On: 24.01.2023 08:21:29; ComponentLink1Description: Datasheet; ComponentLink1URL: https://toshiba.semicon-storage.com/info/TC7SZ86FU_datasheet_en_20170517.pdf?did=54621&prodName=TC7SZ86FU; Component Type: XOR; Device Package: SOT-353; Last Updated: 24.01.2023 08:21:29; Mounting Type: SMD; Operating Temperature: -40 - 85 °C; Series: TC7SZ86; Supplier 1: Mouser; Supplier Part Number 1: 757-TC7SZ86FULJCT; Supplier 2: Digi-Key; Supplier Part Number 2: TC7SZ86FULJ(CTCT-ND; Type: XOR; Live Cycle Status: 1; Stock number: not stored
R53 R55 = AC0603FR-075K6L: SMD resistor E24 series 5.6 kOhms 100mW 0603 1%; Manufacturer: YAGEO; Created from: VStarost; Manufacturer Part Number: AC0603FR-075K6L; PartID: 256; Created On: 10.02.2023 10:25:38; ComponentLink1Description: Datasheet; ComponentLink1URL: https://www.mouser.de/datasheet/2/447/PYu_AC_51_RoHS_L_9-3005297.pdf; Component Type: SMD resistor; Device Package: 0603; Last Updated: 15.02.2023 17:52:13; Mounting Type: SMD; Supplier 1: Mouser; Supplier Part Number 1: 603-AC0603FR-075K6L; Type: Resistor; Value: 5.6k; Live Cycle Status: 1; Stock number: not stored; LCSC Part Number: C177628
R54 = AC0603FR-1333KL: SMD resistor E24 series; Manufacturer: YAGEO; Created from: VStarost; Manufacturer Part Number: AC0603FR-1333KL; PartID: 253; Created On: 24.01.2023 09:59:41; ComponentLink1Description: Datasheet; ComponentLink1URL: https://www.mouser.de/datasheet/2/447/PYu_AC_51_RoHS_L_9-3005297.pdf; Component Type: SMD resistor; Device Package: 0603; Last Updated: 15.02.2023 17:16:43; Mounting Type: SMD; Supplier 1: Mouser; Supplier Part Number 1: 603-AC0603FR-1333KL; Type: Resistor; Value: 33k; Live Cycle Status: 1; Stock number: not stored; LCSC Part Number: C269485

## Nets that join several sheets
+5: TopSheet (5 pins), Power (6 pins), U_Current_Measurement_CAS50001 (7 pins), U_Current_Measurement_CAS50002 (7 pins), U_Current_Measurement_CAS50003 (7 pins), U_Current_Measurement_CAS50004 (7 pins), U_Voltage_Measurement1 (C56A.2 C57A.2 IC7A.3 IC7A.7), U_Voltage_Measurement2 (C56B.2 C57B.2 IC7B.3 IC7B.7), U_Voltage_Measurement3 (C56C.2 C57C.2 IC7C.3 IC7C.7), U_Voltage_Measurement4 (C56D.2 C57D.2 IC7D.3 IC7D.7), U_OC_Trigger1 (5 pins), U_OC_Trigger2 (5 pins), U_OC_Trigger3 (5 pins), U_OC_Trigger4 (5 pins)
+5_PW: TopSheet (R1.2), Power (C22.2 C23.2 D7.2 IC4.6), IM828XCC (C44.2 IC6.5 R7.2 R9.1), U_Connectors/Opt_RX_gate1 (5 pins), U_Connectors/Opt_RX_gate2 (5 pins), U_Connectors/Opt_RX_gate3 (5 pins), U_Connectors/Opt_RX_gate4 (5 pins), U_Connectors/Opt_RX_gate5 (5 pins), U_Connectors/Opt_RX_gate6 (5 pins), U_Connectors/Opt_TX_Fault (5 pins), U_Connectors/Opt_TX_Temp (5 pins), U_Connectors/Opt_RX_en (5 pins)
+5_VREF: Power (C9.2 D1.1 R4.2), U_Voltage_Measurement1 (C54A.2 R29A.2), U_Voltage_Measurement2 (C54B.2 R29B.2), U_Voltage_Measurement3 (C54C.2 R29C.2), U_Voltage_Measurement4 (C54D.2 R29D.2)
+15: Power (C15.2 C16.2 D6.2 IC3.6), IM828XCC (C73.1 IC5.13)
+24_CON: Power (F1.1), Connectors (C69.2 C70.2 J4.1)
DC-: IM828XCC (26 pins), Connectors (J8.1), U_Voltage_Measurement1 (R36A.1), U_Voltage_Measurement2 (R36B.1), U_Voltage_Measurement3 (R36C.1), U_Voltage_Measurement4 (R36D.1)
GND: TopSheet (C1.1 IC1.7 Q1.2 R61.1), Power (25 pins), U_Current_Measurement_CAS50001 (8 pins), U_Current_Measurement_CAS50002 (8 pins), U_Current_Measurement_CAS50003 (8 pins), U_Current_Measurement_CAS50004 (8 pins), Connectors (5 pins), U_Voltage_Measurement1 (6 pins), U_Voltage_Measurement2 (6 pins), U_Voltage_Measurement3 (6 pins), U_Voltage_Measurement4 (6 pins), U_OC_Trigger1 (5 pins), U_OC_Trigger2 (5 pins), U_OC_Trigger3 (5 pins), U_OC_Trigger4 (5 pins)
I_M_OUT1: IM828XCC (IC5.23), U_Current_Measurement_CAS50001 (IC8A.8 IC8A.9 IC8A.10), U_Voltage_Measurement1 (R17A.1)
I_M_OUT2: IM828XCC (IC5.22), U_Current_Measurement_CAS50002 (IC8B.8 IC8B.9 IC8B.10), U_Voltage_Measurement2 (R17B.1)
I_M_OUT3: IM828XCC (IC5.21), U_Current_Measurement_CAS50003 (IC8C.8 IC8C.9 IC8C.10), U_Voltage_Measurement3 (R17C.1)
I_M_OUT4: IM828XCC (23 pins), U_Current_Measurement_CAS50004 (IC8D.8 IC8D.9 IC8D.10), U_Voltage_Measurement4 (R17D.1)
PGND: TopSheet (R3.1), Power (8 pins), IM828XCC (15 pins), U_Connectors/Opt_RX_gate1 (5 pins), U_Connectors/Opt_RX_gate2 (5 pins), U_Connectors/Opt_RX_gate3 (5 pins), U_Connectors/Opt_RX_gate4 (5 pins), U_Connectors/Opt_RX_gate5 (5 pins), U_Connectors/Opt_RX_gate6 (5 pins), U_Connectors/Opt_TX_Fault (C68A.1 IC11A.3 R52A.1), U_Connectors/Opt_TX_Temp (C68B.1 IC11B.3 R52B.1), U_Connectors/Opt_RX_en (5 pins)
Gate1: IM828XCC (R11.1), U_Connectors/Opt_RX_gate1 (IC10A.4 R48A.2)
Gate2: IM828XCC (R16.1), U_Connectors/Opt_RX_gate2 (IC10B.4 R48B.2)
Gate3: IM828XCC (R12.1), U_Connectors/Opt_RX_gate3 (IC10C.4 R48C.2)
Gate4: IM828XCC (R15.1), U_Connectors/Opt_RX_gate4 (IC10D.4 R48D.2)
Gate5: IM828XCC (R13.1), U_Connectors/Opt_RX_gate5 (IC10E.4 R48E.2)
Gate6: IM828XCC (R14.1), U_Connectors/Opt_RX_gate6 (IC10F.4 R48F.2)
I_IN1: U_Current_Measurement_CAS50001 (IC8A.1 IC8A.2 IC8A.3), Connectors (J3.1)
I_IN2: U_Current_Measurement_CAS50002 (IC8B.1 IC8B.2 IC8B.3), Connectors (J6.1)
I_IN3: U_Current_Measurement_CAS50003 (IC8C.1 IC8C.2 IC8C.3), Connectors (J9.1)
I_IN4: U_Current_Measurement_CAS50004 (IC8D.1 IC8D.2 IC8D.3), Connectors (J5.1)
I_OUT_N1: U_Current_Measurement_CAS50001 (R40A.2 R42A.2), Connectors (J10.A3)
I_OUT_N2: U_Current_Measurement_CAS50002 (R40B.2 R42B.2), Connectors (J10.A4)
I_OUT_N3: U_Current_Measurement_CAS50003 (R40C.2 R42C.2), Connectors (J10.A7)
I_OUT_N4: U_Current_Measurement_CAS50004 (R40D.2 R42D.2), Connectors (J10.B8)
I_OUT_P1: U_Current_Measurement_CAS50001 (R43A.2 R45A.2), Connectors (J10.A6)
I_OUT_P2: U_Current_Measurement_CAS50002 (R43B.2 R45B.2), Connectors (J10.A5)
I_OUT_P3: U_Current_Measurement_CAS50003 (R43C.2 R45C.2), Connectors (J10.A8)
I_OUT_P4: U_Current_Measurement_CAS50004 (R43D.2 R45D.2), Connectors (J10.B7)
NetC36_2: TopSheet (OP1.3 R3.2), IM828XCC (C36.2 IC5.15)
NetIC6_6: IM828XCC (IC6.6), U_Connectors/Opt_TX_Temp (IC11B.2 R52B.2)
NetIC10G_4: IM828XCC (R60.1), U_Connectors/Opt_RX_en (IC10G.4 R48G.2)
NetIC11A_2: IM828XCC (R5.2 R60.2), U_Connectors/Opt_TX_Fault (IC11A.2 R52A.2)
OC_IN1: U_Current_Measurement_CAS50001 (IC8A.12 R41A.1), U_OC_Trigger1 (IC12A.2 IC12A.5)
OC_IN2: U_Current_Measurement_CAS50002 (IC8B.12 R41B.1), U_OC_Trigger2 (IC12B.2 IC12B.5)
OC_IN3: U_Current_Measurement_CAS50003 (IC8C.12 R41C.1), U_OC_Trigger3 (IC12C.2 IC12C.5)
OC_IN4: U_Current_Measurement_CAS50004 (IC8D.12 R41D.1), U_OC_Trigger4 (IC12D.2 IC12D.5)
OC_OUT1: TopSheet (IC1.2), U_OC_Trigger1 (IC13A.4)
OC_OUT2: TopSheet (IC1.1), U_OC_Trigger2 (IC13B.4)
OC_OUT3: TopSheet (IC1.5), U_OC_Trigger3 (IC13C.4)
OC_OUT4: TopSheet (IC1.4), U_OC_Trigger4 (IC13D.4)
V_OUT_N1: Connectors (J10.B2), U_Voltage_Measurement1 (R25A.2 R27A.2)
V_OUT_N2: Connectors (J10.B6), U_Voltage_Measurement2 (R25B.2 R27B.2)
V_OUT_N3: Connectors (J10.B5), U_Voltage_Measurement3 (R25C.2 R27C.2)
V_OUT_N4: Connectors (J10.A2), U_Voltage_Measurement4 (R25D.2 R27D.2)
V_OUT_P1: Connectors (J10.B1), U_Voltage_Measurement1 (R28A.2 R30A.2)
V_OUT_P2: Connectors (J10.B3), U_Voltage_Measurement2 (R28B.2 R30B.2)
V_OUT_P3: Connectors (J10.B4), U_Voltage_Measurement3 (R28C.2 R30C.2)
V_OUT_P4: Connectors (J10.A1), U_Voltage_Measurement4 (R28D.2 R30D.2)